# Altium schematic sheet Sheet1.SchDoc: 8-Port USB Video Switch
size B; Author: Micah Dowty; DrawnBy: Micah Dowty; Revision: A
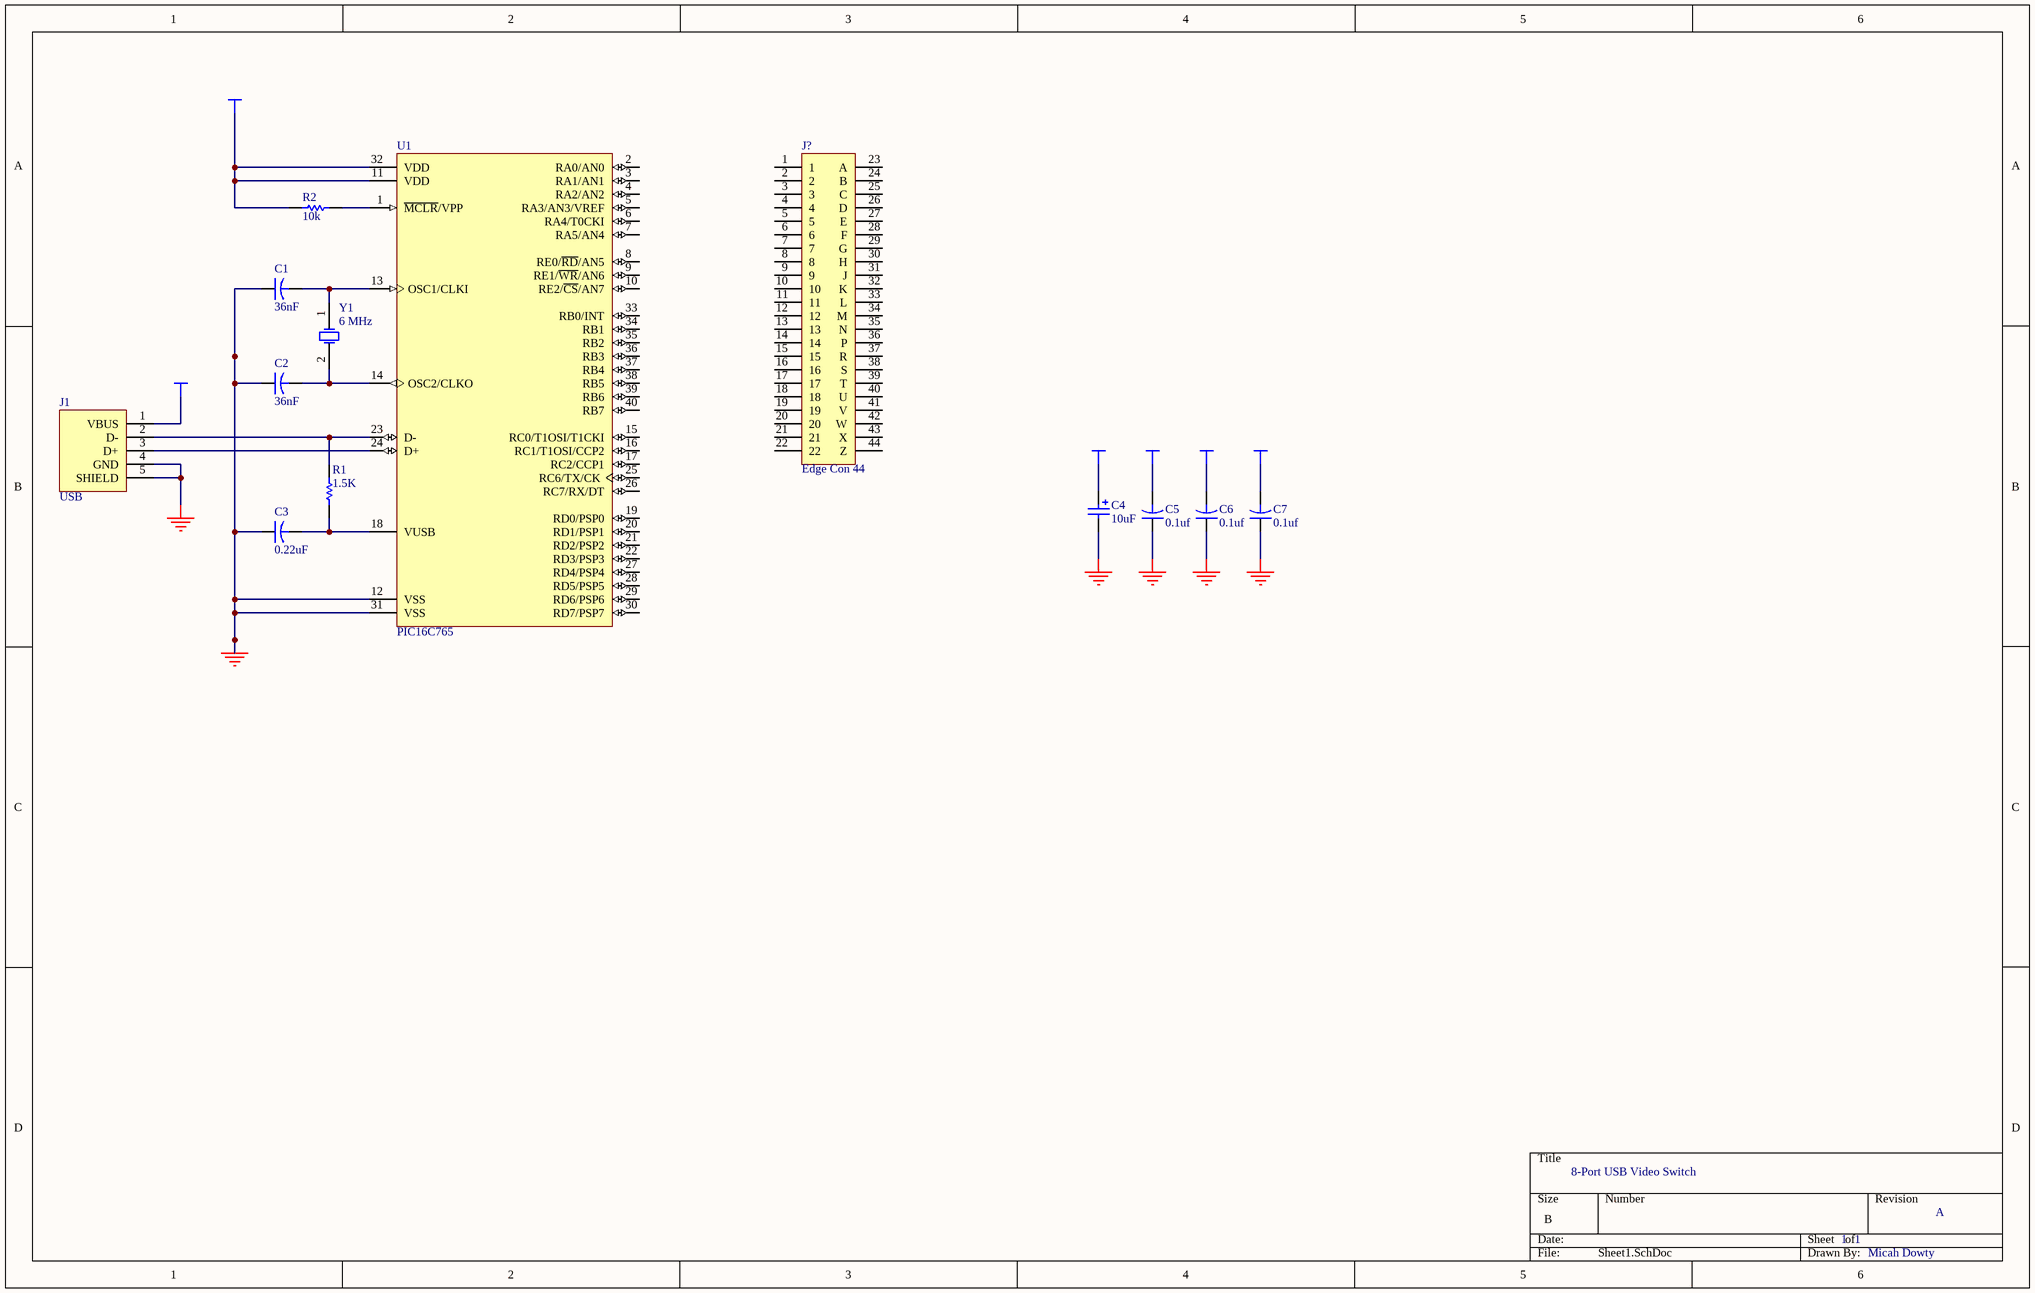
[diagram p0: Sheet1.SchDoc]

## Parts
C1  value 36nF  [CAPR5-4X5]  (hidden comment: Cap2)
C2  value 36nF  [CAPR5-4X5]  (hidden comment: Cap2)
C3  value 0.22uF  [CAPR5-4X5]
C4  10uF  [CAP-EE-1]
C5  value 0.1uf  [CAPR5-4X5]
C6  value 0.1uf  [CAPR5-4X5]
C7  value 0.1uf  [CAPR5-4X5]
J1  USB  [USB-TYPEB]
J?  Edge Con 44  [PIN44]
R1  value 1.5K  [AXIAL-0.3]  (hidden comment: Res1)
R2  value 10k  [AXIAL-0.3]  (hidden comment: Res1)
U1  PIC16C765  [DIP-40]
Y1  6 MHz  [BCY-W2/E4.7]

## Nets
GND: C1.1 C2.1 C3.1 C4.2 C5.1 C6.1 C7.1 J1.4(GND) J1.5(SHIELD) U1.12(VSS) U1.31(VSS)
VCC: C4.1 C5.2 C6.2 C7.2 J1.1(VBUS) R2.2 U1.11(VDD) U1.32(VDD)
NetC1_2: C1.2 U1.13(OSC1/CLKI) Y1.1(OSC1)
NetC2_2: C2.2 U1.14(OSC2/CLKO) Y1.2(OSC2)
NetC3_2: C3.2 R1.1 U1.18(VUSB)
NetJ1_2: J1.2(D-) R1.2 U1.23(D-)
NetJ1_3: J1.3(D+) U1.24(D+)
NetR2_1: R2.1 U1.1(~{MCLR}/VPP)

Not connected (* = marked no-connect by the designer): J? 1 2 3 4 5 6 7 8 9 10 11 12 13 14 15 16 17 18 19 20 21 22 23(A) 24(B) 25(C) 26(D) 27(E) 28(F) 29(G) 30(H) 31(J) 32(K) 33(L) 34(M) 35(N) 36(P) 37(R) 38(S) 39(T) 40(U) 41(V) 42(W) 43(X) 44(Z); U1 2(RA0/AN0) 3(RA1/AN1) 4(RA2/AN2) 5(RA3/AN3/VREF) 6(RA4/T0CKI) 7(RA5/AN4) 8(RE0/~{RD}/AN5) 9(RE1/~{WR}/AN6) 10(RE2/~{CS}/AN7) 15(RC0/T1OSI/T1CKI) 16(RC1/T1OSI/CCP2) 17(RC2/CCP1) 19(RD0/PSP0) 20(RD1/PSP1) 21(RD2/PSP2) 22(RD3/PSP3) 25(RC6/TX/CK) 26(RC7/RX/DT) 27(RD4/PSP4) 28(RD5/PSP5) 29(RD6/PSP6) 30(RD7/PSP7) 33(RB0/INT) 34(RB1) 35(RB2) 36(RB3) 37(RB4) 38(RB5) 39(RB6) 40(RB7)

## Notes on the sheet
- 8-Port USB Video Switch
- 1
- A
- Micah Dowty

## Library data of the parts
C1-C3 C5-C7 = Cap2: Capacitor; Manufacturer: Generic Components; Class I: Passive; Published: 23-Sep-2002; Publisher: Altium Limited; Class II: Capacitor
C4 = Cap Pol1: Polarized Capacitor (Radial); Manufacturer: Generic Components; Class I: Passive; Published: 8-Jun-2000; Revision: July-2002: Re-released for DXP Platform.; Publisher: Altium Limited; Class II: Capacitor; Value: 10uF
J1 = USB Type B: Header, 4-Pin; Manufacturer: Generic Components; Class I: Connector; Revision: July-2002: Re-released for DXP Platform.; Publisher: Altium Limited
J? = Edge Con 44: 44-Pin Edge Connector; Manufacturer: Generic Components; Revision: July-2002: Re-released for DXP Platform.; Publisher: Altium Limited; Class I: Connector
R1 R2 = Res1: Resistor; Manufacturer: Generic Components; Class I: Passive; Published: 8-Jun-2000; Revision: July-2002: Re-released for DXP Platform.; Publisher: Altium Limited; Class II: Resistor
U1 = PIC16C765: EPROM-Based 8-Bit CMOS Microcontroller with USB; Manufacturer: Microchip; Revision: Modified for PIC16C745 by Micah Dowty; Package Reference: P40; Class I: Microcontroller; Class II: 8-bit
Y1 = XTAL: Crystal Oscillator; Manufacturer: Generic Components; Published: 8-Jun-2000; Revision: July-2002: Re-released for DXP Platform.; Publisher: Altium Limited; Class I: Oscillator; Class II: Crystal Oscillator